# EAGLE design PIC 16F877A Board (EAGLE 9.6.2)
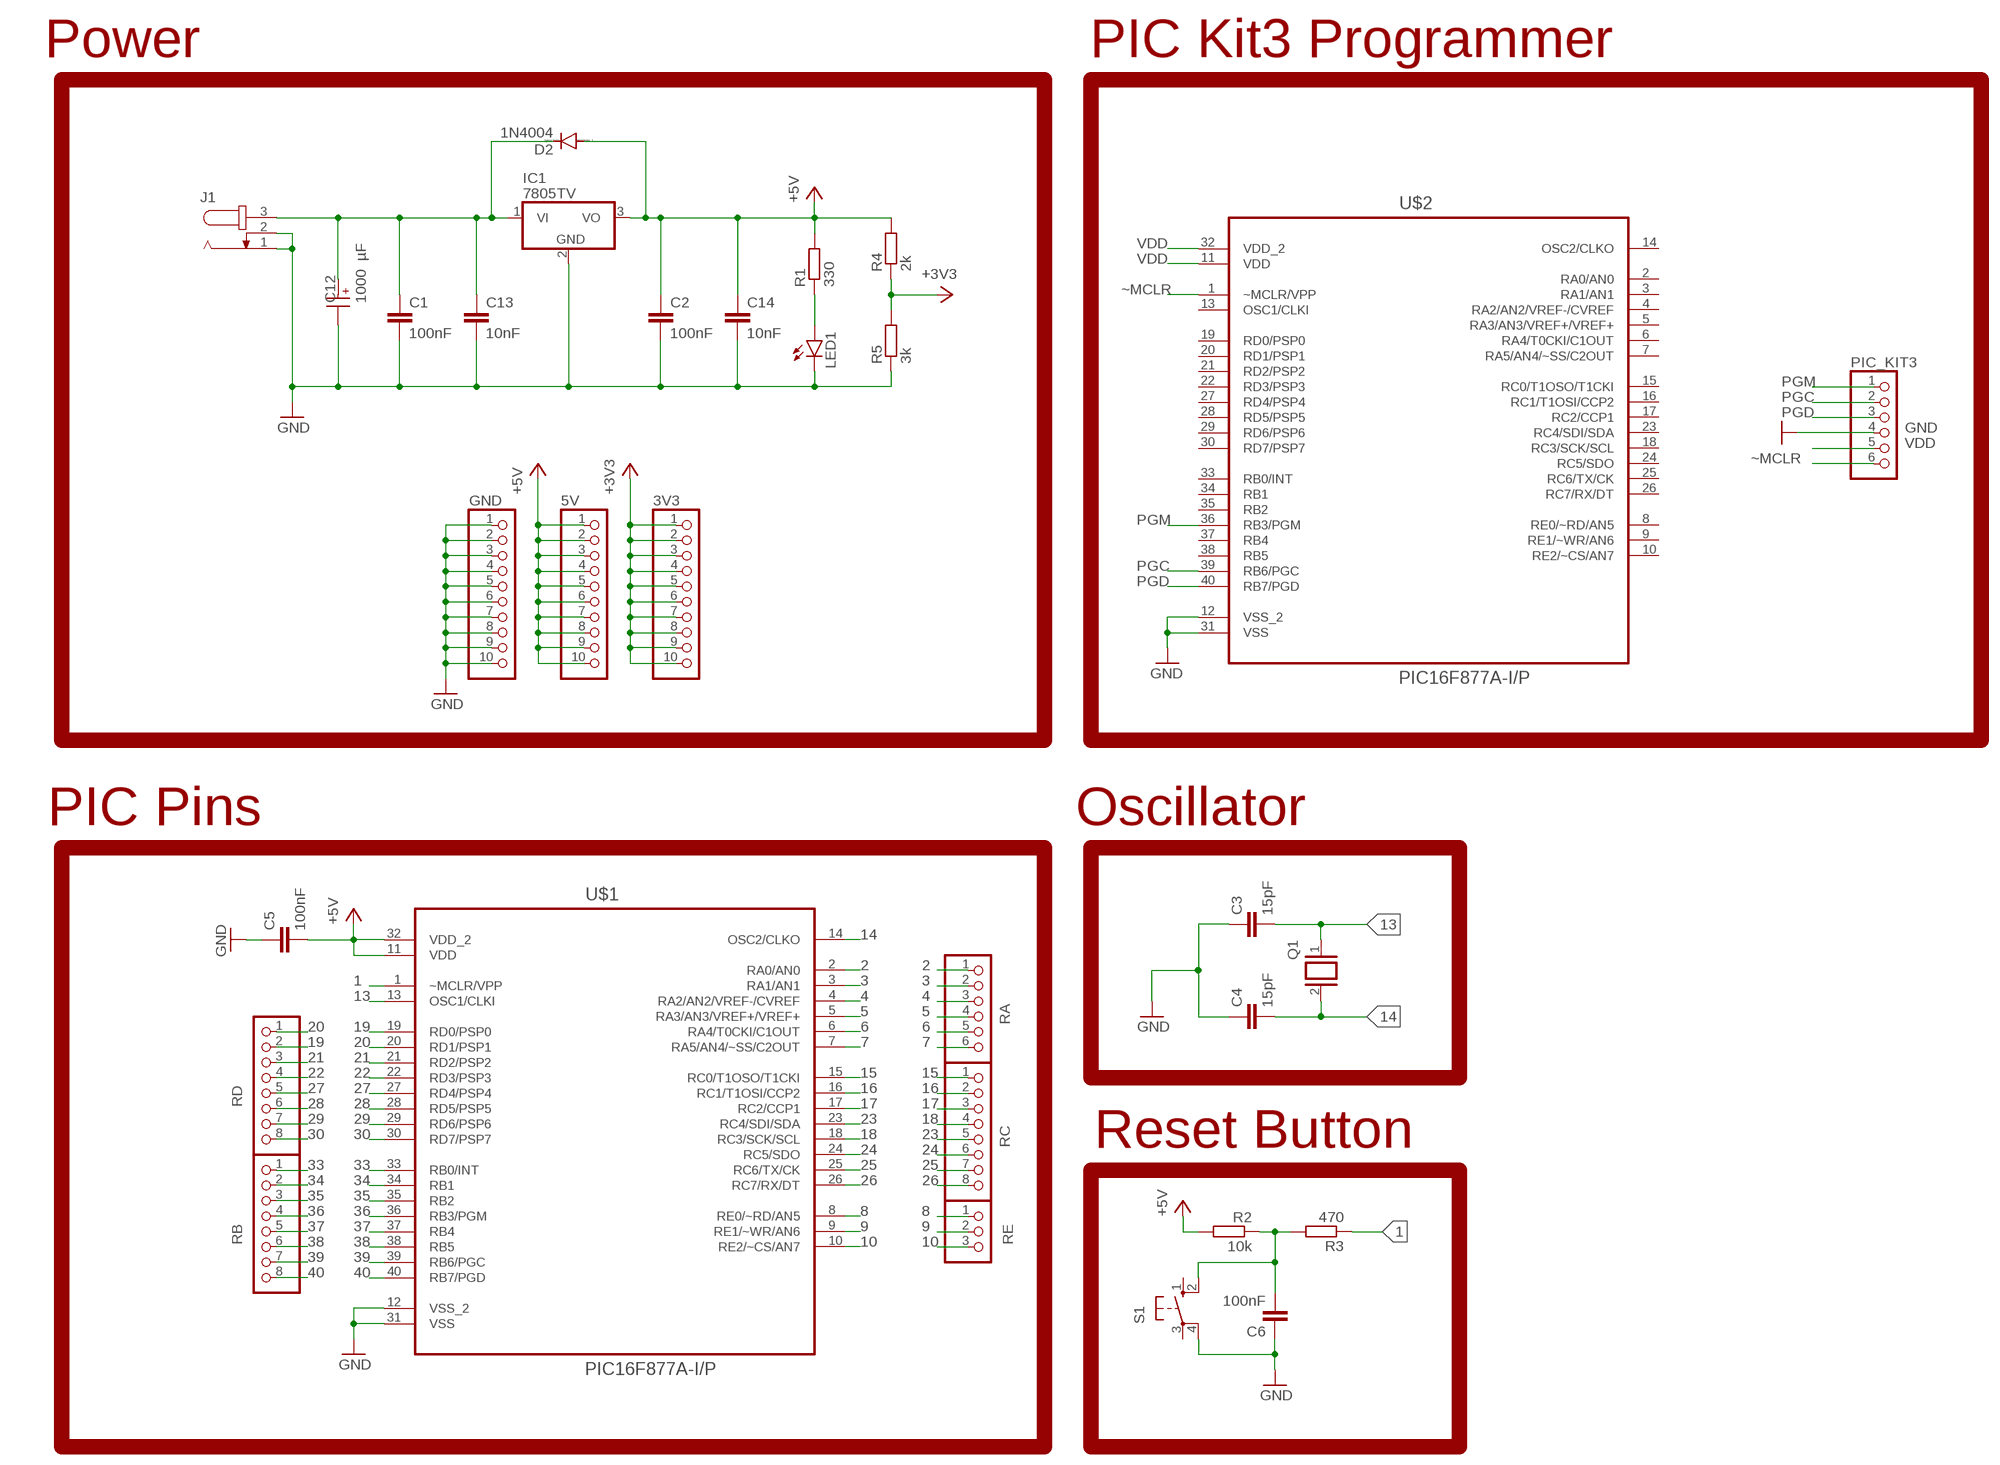
[diagram p0: schematic, sheet 1]

## Parts
3V3  PINHD-1X10  [1X10]
5V  PINHD-1X10  [1X10]
C1  100nF  C-EU025-025X050  [C025-025X050]
C2  100nF  C-EU025-025X050  [C025-025X050]
C3  15pF  C-EU025-025X050  [C025-025X050]
C4  15pF  C-EU025-025X050  [C025-025X050]
C5  100nF  C-EU025-025X050  [C025-025X050]
C6  100nF  C-EU025-025X050  [C025-025X050]
C12  1000 µF  WCAP-ATG8_10X12.5_860010275016  [WCAP-ATG8_10X12.5(DXL)]
C13  10nF  C-EU025-025X050  [C025-025X050]
C14  10nF  C-EU025-025X050  [C025-025X050]
D2  1N4004  [DO41-10]
GND  PINHD-1X10  [1X10]
IC1  7805TV  [TO220V]
J1  JACK-PLUG0  [SPC4077]
LED1  LED3MM  [LED3MM]
PIC_KIT3  PINHD-1X6  [1X06]
Q1  XTAL/S  [QS]
R1  330  R-EU_0204/7  [0204/7]
R2  10k  R-EU_0204/7  [0204/7]
R3  470  R-EU_0204/7  [0204/7]
R4  2k  R-EU_0204/7  [0204/7]
R5  3k  R-EU_0204/7  [0204/7]
RA  PINHD-1X6  [1X06]
RB  PINHD-1X8  [1X08]
RC  PINHD-1X8  [1X08]
RD  PINHD-1X8  [1X08]
RE  PINHD-1X3  [1X03]
S1  10-XX  [B3F-10XX]
U$1  PIC16F877A-I/P  [16F877A]
U$2  PIC16F877A-I/P  [16F877A]

## Nets
1: R3.1 U$1.1(~MCLR/VPP)
2: RA.1 U$1.2(RA0/AN0)
3: RA.2 U$1.3(RA1/AN1)
4: RA.3 U$1.4(RA2/AN2/VREF-/CVREF)
5: RA.4 U$1.5(RA3/AN3/VREF+/VREF+)
6: RA.5 U$1.6(RA4/T0CKI/C1OUT)
7: RA.6 U$1.7(RA5/AN4/~SS/C2OUT)
8: RE.1 U$1.8(RE0/~RD/AN5)
9: RE.2 U$1.9(RE1/~WR/AN6)
10: RE.3 U$1.10(RE2/~CS/AN7)
13: C3.2 Q1.1 U$1.13(OSC1/CLKI)
14: C4.2 Q1.2 U$1.14(OSC2/CLKO)
15: RC.1 U$1.15(RC0/T1OSO/T1CKI)
16: RC.2 U$1.16(RC1/T1OSI/CCP2)
17: RC.3 U$1.17(RC2/CCP1)
18: RC.4 U$1.18(RC3/SCK/SCL)
19: RD.2 U$1.19(RD0/PSP0)
20: RD.1 U$1.20(RD1/PSP1)
21: RD.3 U$1.21(RD2/PSP2)
22: RD.4 U$1.22(RD3/PSP3)
23: RC.5 U$1.23(RC4/SDI/SDA)
24: RC.6 U$1.24(RC5/SDO)
25: RC.7 U$1.25(RC6/TX/CK)
26: RC.8 U$1.26(RC7/RX/DT)
27: RD.5 U$1.27(RD4/PSP4)
28: RD.6 U$1.28(RD5/PSP5)
29: RD.7 U$1.29(RD6/PSP6)
30: RD.8 U$1.30(RD7/PSP7)
33: RB.1 U$1.33(RB0/INT)
34: RB.2 U$1.34(RB1)
35: RB.3 U$1.35(RB2)
36: RB.4 U$1.36(RB3/PGM)
37: RB.5 U$1.37(RB4)
38: RB.6 U$1.38(RB5)
39: RB.7 U$1.39(RB6/PGC)
40: RB.8 U$1.40(RB7/PGD)
+3V3: 3V3.1 3V3.2 3V3.3 3V3.4 3V3.5 3V3.6 3V3.7 3V3.8 3V3.9 3V3.10 R4.1 R5.2
+5V: 5V.1 5V.2 5V.3 5V.4 5V.5 5V.6 5V.7 5V.8 5V.9 5V.10 C2.1 C5.2 C14.1 D2.A IC1.3(VO) R1.2 R2.2 R4.2 U$1.11(VDD) U$1.32(VDD_2)
GND: C1.2 C2.2 C3.1 C4.1 C5.1 C6.1 C12.2(-) C13.2 C14.2 GND.1 GND.2 GND.3 GND.4 GND.5 GND.6 GND.7 GND.8 GND.9 GND.10 IC1.2(GND) J1.1 J1.2 LED1.K(C) PIC_KIT3.4 R5.1 S1.4(P1) U$1.12(VSS_2) U$1.31(VSS) U$2.12(VSS_2) U$2.31(VSS)
N$1: C1.1 C12.1(+) C13.1 D2.C IC1.1(VI) J1.3
N$2: C6.2 R2.1 R3.2 S1.2(S1)
N$4: LED1.A R1.1
PGC: PIC_KIT3.2 U$2.39(RB6/PGC)
PGD: PIC_KIT3.3 U$2.40(RB7/PGD)
PGM: PIC_KIT3.1 U$2.36(RB3/PGM)
VDD: PIC_KIT3.5 U$2.11(VDD) U$2.32(VDD_2)
~MCLR: PIC_KIT3.6 U$2.1(~MCLR/VPP)
Unconnected: S1.1(S) S1.3(P) U$2.2(RA0/AN0) U$2.3(RA1/AN1) U$2.4(RA2/AN2/VREF-/CVREF) U$2.5(RA3/AN3/VREF+/VREF+) U$2.6(RA4/T0CKI/C1OUT) U$2.7(RA5/AN4/~SS/C2OUT) U$2.8(RE0/~RD/AN5) U$2.9(RE1/~WR/AN6) U$2.10(RE2/~CS/AN7) U$2.13(OSC1/CLKI) U$2.14(OSC2/CLKO) U$2.15(RC0/T1OSO/T1CKI) U$2.16(RC1/T1OSI/CCP2) U$2.17(RC2/CCP1) U$2.18(RC3/SCK/SCL) U$2.19(RD0/PSP0) U$2.20(RD1/PSP1) U$2.21(RD2/PSP2) U$2.22(RD3/PSP3) U$2.23(RC4/SDI/SDA) U$2.24(RC5/SDO) U$2.25(RC6/TX/CK) U$2.26(RC7/RX/DT) U$2.27(RD4/PSP4) U$2.28(RD5/PSP5) U$2.29(RD6/PSP6) U$2.30(RD7/PSP7) U$2.33(RB0/INT) U$2.34(RB1) U$2.35(RB2) U$2.37(RB4) U$2.38(RB5)

## Notes on the sheet
- Power | PIC Kit3 Programmer
- PIC Pins | Oscillator
- Reset Button

## Library data of the parts
3V3 5V GND = pinhead:PINHD-1X10: PIN HEADER
C1-C6 C13 C14 = rcl:C-EU: CAPACITOR, European symbol; SPICEPREFIX: C
C12 = Aluminium Electrolyt Capacitors:WCAP-ATG8_10X12.5: WCAP-ATG8 Aluminium Electrolytic Capacitors General Purpose +85 °C Characteristics General purpose product series with max. operating temperature of +85 °C Wide range of capacitance value Mounting style: THT Radial Capacitance range: 0.1 µF ‒ 33000 µF Capacitance tolerance: ±20 % Voltage range (UR): 10 ‒ 400 V(DC) Operating temperature: -40 °C up to +85 °C for UR < 400 V(DC) -25 °C up to +85 °C for UR ≥ 400 V(DC) Endurance: 2000 h @ +85 °C Dimensions (DxL) in mm: 5.0 x 11.0 up to 22.0 x 51.0 Recommended soldering: Wave soldering Applications Filtering Smoothing Energy storage Coupling <https://www.we-online.com/catalog/media/o35732v209%20WCAP-ATG8_4C.jpg> Details see: https://www.we-online.com/catalog/en/WCAP-ATG8/ Updated by yingchun,Shan;2020-02-27 2020(C) Würth Elektronik; DATASHEET-URL: https://www.we-online.com/catalog/datasheet/860010275016.pdf; DF: 19%; DIAMETER: 10mm; I-LEAK: 100uA; I-RIPPLE: 726mA; L: 12.5mm; OPERATING-TEMPERATURE: -40 °C up to +85 °C; PART-NUMBER: 860010275016; PITCH: 5mm; TECHNICAL-REFERENCE: ATBF125102M010DSPA9B000; VR: 10V(DC)
D2 = diode:1N4004: DIODE general purpose rectifier, 1 A
IC1 = linear:78*: Positive VOLTAGE REGULATOR Source: http://cache.national.com/ds/LM/LM78L05.pdf http://www.fairchildsemi.com/ds/LM/LM7805.pdf
J1 = con-jack:JACK-PLUG: DC POWER JACK Power Jack, DC, Right Angle, Through Hole, Rated 5A at 16VDC, PC Terminals Distributor: Farnell (www.Farnell.de) Drawing: 84N1161.pdf / 84N1162.pdf Manufacturer: SPC Technology (www.spctechnology.com) Type: SPC4077 / SPC 4078; OC_FARNELL: unknown; OC_NEWARK: unknown
LED1 = led:LED: LED OSRAM: - CHIPLED LG R971, LG N971, LY N971, LG Q971, LY Q971, LO R971, LY R971 LH N974, LH R974 LS Q976, LO Q976, LY Q976 LO Q996 - Hyper CHIPLED LW Q18S LB Q993, LB Q99A, LB R99A - SideLED LS A670, LO A670, LY A670, LG A670, LP A670 LB A673, LV A673, LT A673, LW A673 LH A674 LY A675 LS A676, LA A676, LO A676, LY A676, LW A676 LS A679, LY A679, LG A679 - Hyper Micro SIDELED® LS Y876, LA Y876, LO Y876, LY Y876 LT Y87S - SmartLED LW L88C, LW L88S LB L89C, LB L89S, LG L890 LS L89K, LO L89K, LY L89K LS L896, LA L896, LO L896, LY L896 - TOPLED LS T670, LO T670, LY T670, LG T670, LP T670 LSG T670, LSP T670, LSY T670, LOP T670, LYG T670 LG T671, LOG T671, LSG T671 LB T673, LV T673, LT T673, LW T673 LH T674 LS T676, LA T676, LO T676, LY T676, LB T676, LH T676, LSB T676, LW T676 LB T67C, LV T67C, LT T67C, LS T67K, LO T67K, LY T67K, LW E67C LS E67B, LA E67B, LO E67B, LY E67B, LB E67C, LV E67C, LT E67C LW T67C LS T679, LY T679, LG T679 LS T770, LO T770, LY T770, LG T770, LP T770 LB T773, LV T773, LT T773, LW T773 LH T774 LS E675, LA E675, LY E675, LS T675 LS T776, LA T776, LO T776, LY T776, LB T776 LHGB T686 LT T68C, LB T68C - Hyper Mini TOPLED® LB M676 - Mini TOPLED Santana® LG M470 LS M47K, LO M47K, LY M47K Source: http://www.osram.convergy.de LUXEON: - LUMILED® LXK2-PW12-R00, LXK2-PW12-S00, LXK2-PW14-U00, LXK2-PW14-V00 LXK2-PM12-R00, LXK2-PM12-S00, LXK2-PM14-U00 LXK2-PE12-Q00, LXK2-PE12-R00, LXK2-PE12-S00, LXK2-PE14-T00, LXK2-PE14-U00 LXK2-PB12-K00, LXK2-PB12-L00, LXK2-PB12-M00, LXK2-PB14-N00, LXK2-PB14-P00, LXK2-PB14-Q00 LXK2-PR12-L00, LXK2-PR12-M00, LXK2-PR14-Q00, LXK2-PR14-R00 LXK2-PD12-Q00, LXK2-PD12-R00, LXK2-PD12-S00 LXK2-PH12-R00, LXK2-PH12-S00 LXK2-PL12-P00, LXK2-PL12-Q00, LXK2-PL12-R00 Source: www.luxeon.com KINGBRIGHT: KA-3528ASYC Source: www.kingbright.com
PIC_KIT3 RA = pinhead:PINHD-1X6: PIN HEADER
Q1 = special:XTAL/S: CRYSTAL
R1-R5 = rcl:R-EU_: RESISTOR, European symbol; SPICEPREFIX: R
RB RC RD = pinhead:PINHD-1X8: PIN HEADER
RE = pinhead:PINHD-1X3: PIN HEADER
S1 = switch-omron:10-XX: OMRON SWITCH; MPN: B3F-1000; OC_FARNELL: 176432; OC_NEWARK: 36M3542
U$1 U$2 = PIC - 16F877A:PIC16F877A-I/P: 8-Bit CMOS FLASH Microcontrollers Check prices <https://pricing.snapeda.com/parts/PIC16F877A-I/P/Microchip/view-part?ref=eda>; AVAILABILITY: Good; DESCRIPTION: PIC PIC® 16F Microcontroller IC 8-Bit 20MHz 14KB (8K x 14) FLASH 44-TQFP (10x10); MF: Microchip; MP: PIC16F877A-I/P; PACKAGE: DIP-40 Microchip; PRICE: None; PURCHASE-URL: https://pricing.snapeda.com/search/part/PIC16F877A-I/P/?ref=eda

## Board
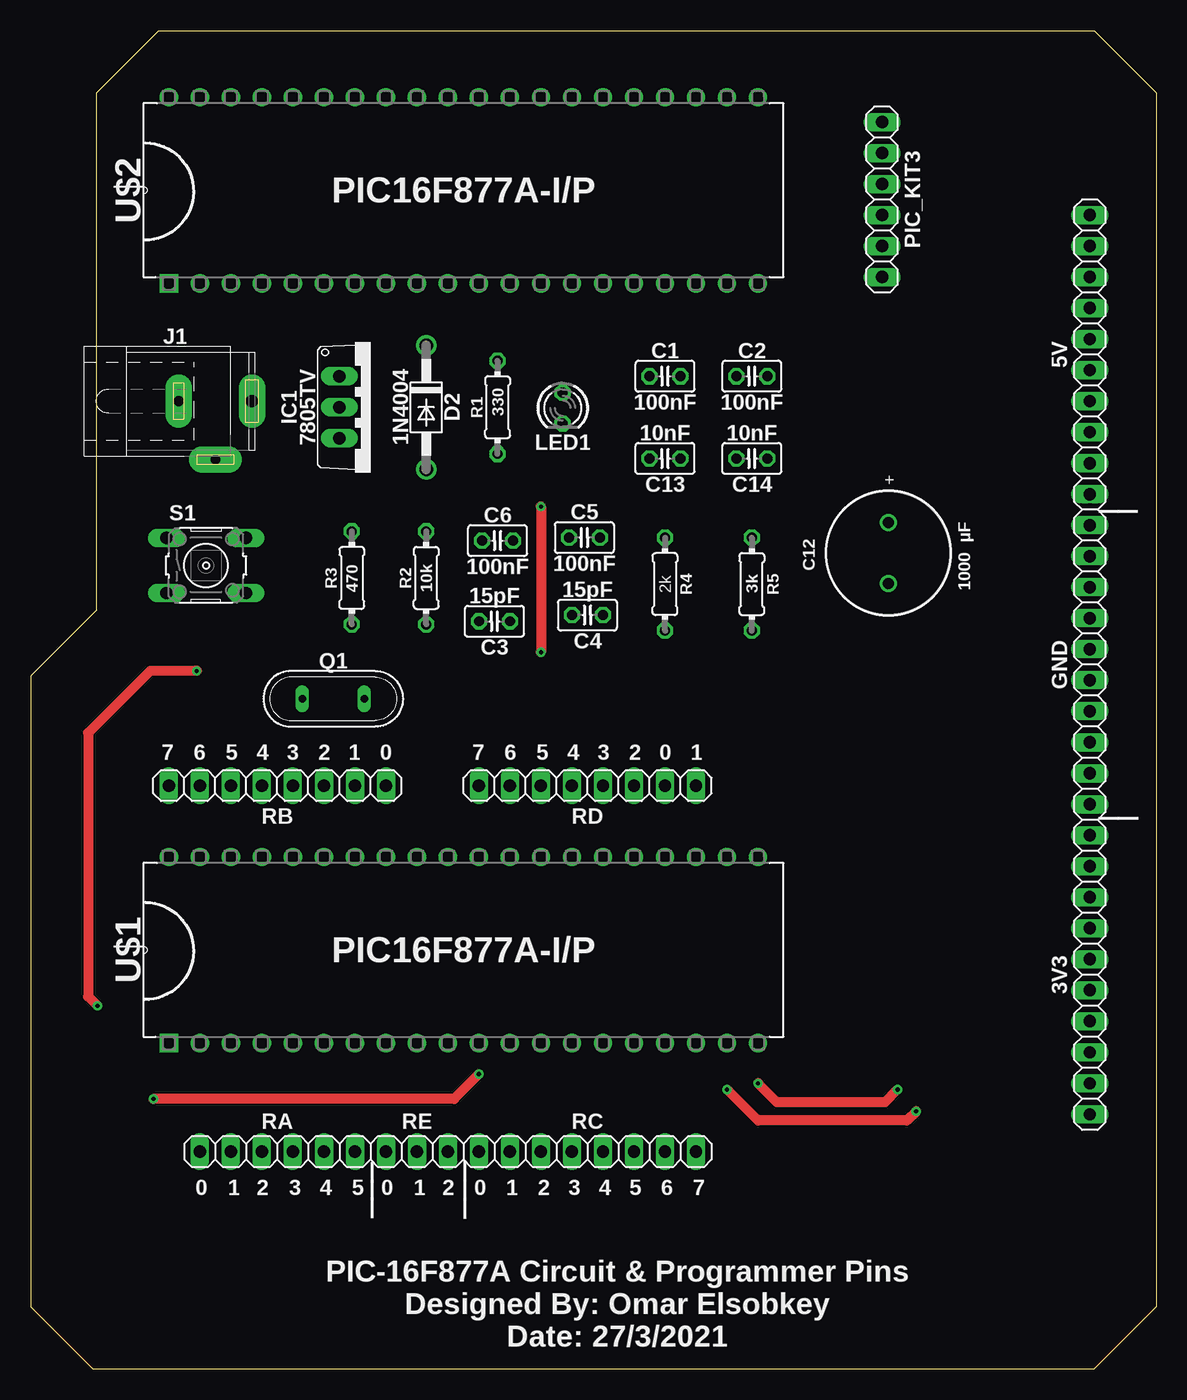
[diagram p1: board, top side]
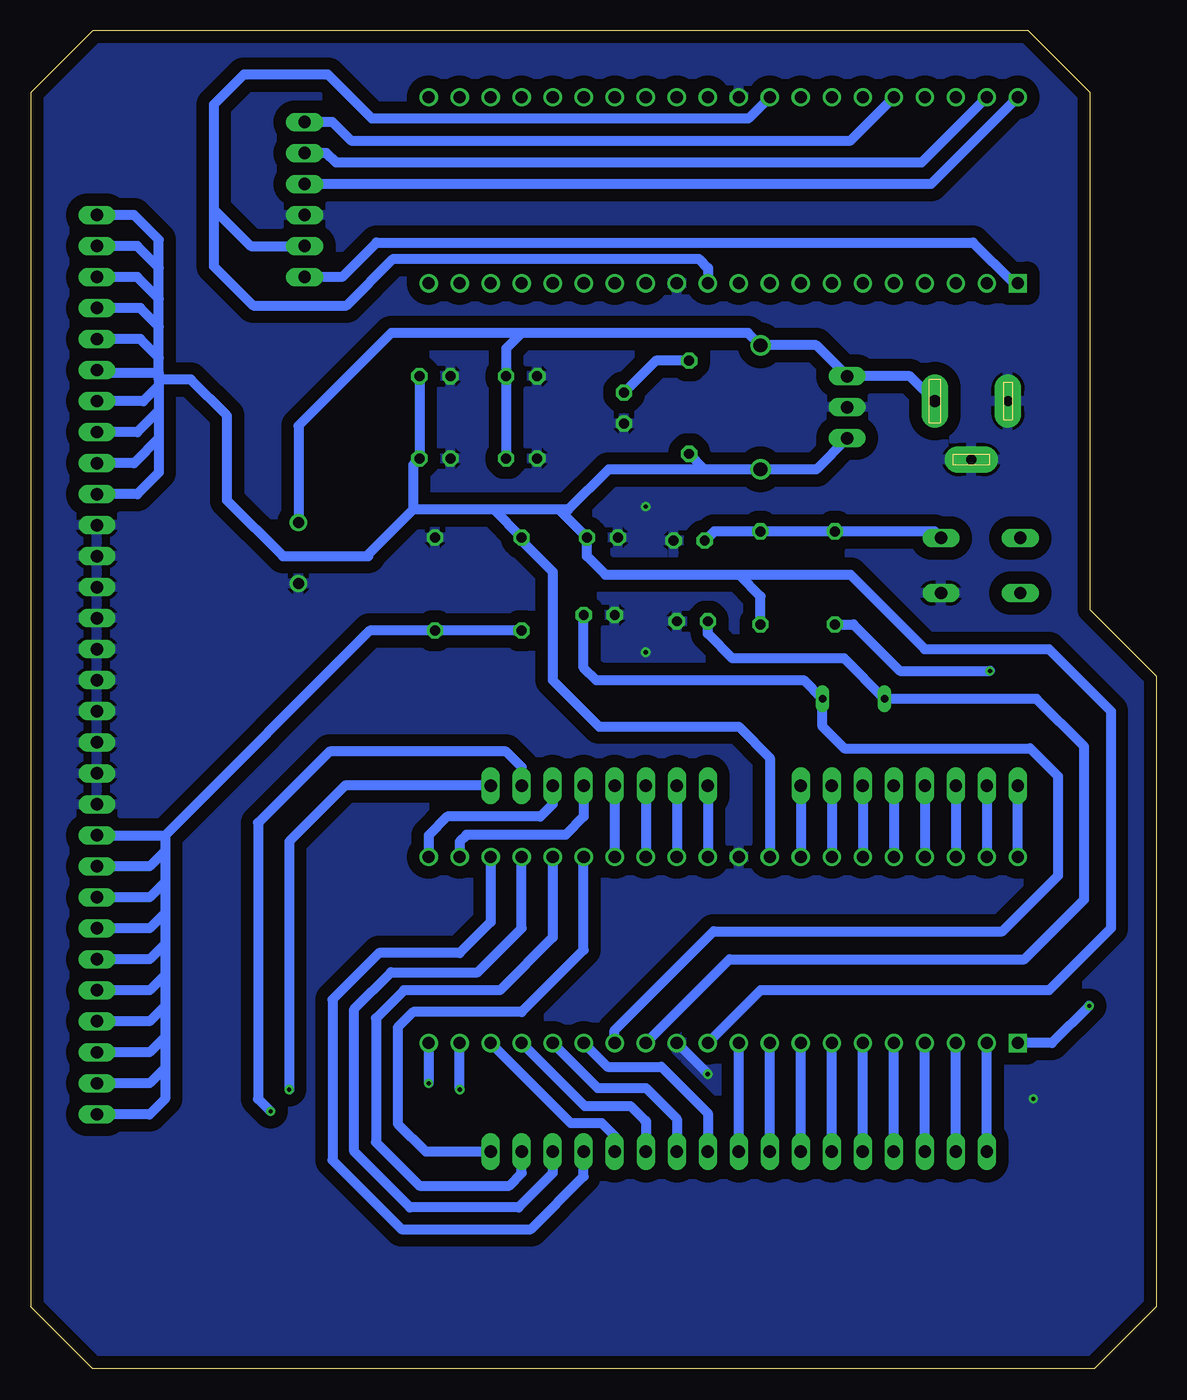
[diagram p2: board, bottom side, seen from below]

Size 92.2 x 109.63 mm. Coordinates in mm from the lower left corner, seen from the top.
Outline: 5.41,62.18 5.41,104.55 10.49,109.63 87.12,109.63 92.2,104.55 92.2,5.08 87.12,0 5.08,0 0,5.08 0,56.77 5.41,62.18
Copper layers (1*16): Top 0.035mm / dielectric 1.5mm / Bottom 0.035mm
Design rules "default *": minimum track width 32mil, minimum drill 0.35mm, track to track 16mil, track to pad 16mil, pad to pad 6mil, via to via 6mil, smd to smd 6mil, copper to edge 40mil, drill to drill 6mil, minimum pad ring 10mil, minimum via ring 8mil, stop-mask expansion 4mil, vias tented up to drill 0mil, thermal gap 10mil

### Footprints (pad centres in the part's own frame; a part is rotated, then mirrored left to right if it is on the bottom)
1X10 = drill 1.016 long: 1 -11.43,0; 2 -8.89,0; 3 -6.35,0; 4 -3.81,0; 5 -1.27,0; 6 1.27,0; 7 3.81,0; 8 6.35,0; 9 8.89,0; 10 11.43,0
C025-025X050 = drill 0.813 octagon: 1 -1.27,0; 2 1.27,0
WCAP-ATG8_10X12.5(DXL) = drill 0.9: 1 2.5,0; 2 -2.5,0
DO41-10 = drill 1.118: A 5.08,0; C -5.08,0
TO220V = drill 1.016 long: 1 -2.54,-2.54; 2 0,-2.54; 3 2.54,-2.54
SPC4077 = drill 0.8 pad 2.184 long: 1 -3,0; 2 0,-4.8 | drill 1 pad 2.184 long: 3 3,0
LED3MM = drill 0.813 octagon: A -1.27,0; K 1.27,0
1X06 = drill 1.016 long: 1 -6.35,0; 2 -3.81,0; 3 -1.27,0; 4 1.27,0; 5 3.81,0; 6 6.35,0
QS = drill 0.61 long: 1 -2.54,0; 2 2.54,0
0204/7 = drill 0.813 octagon: 1 -3.81,0; 2 3.81,0
1X08 = drill 1.016 long: 1 -8.89,0; 2 -6.35,0; 3 -3.81,0; 4 -1.27,0; 5 1.27,0; 6 3.81,0; 7 6.35,0; 8 8.89,0
1X03 = drill 1.016 long: 1 -2.54,0; 2 0,0; 3 2.54,0
B3F-10XX = drill 1.016 long: 1 -3.251,2.261; 2 3.251,2.261; 3 -3.251,-2.261; 4 3.251,-2.261
16F877A = drill 0.991 square: 1 -15.24,48.26 | drill 0.991: 2 -15.24,45.72; 3 -15.24,43.18; 4 -15.24,40.64; 5 -15.24,38.1; 6 -15.24,35.56; 7 -15.24,33.02; 8 -15.24,30.48; 9 -15.24,27.94; 10 -15.24,25.4; 11 -15.24,22.86; 12 -15.24,20.32; 13 -15.24,17.78; 14 -15.24,15.24; 15 -15.24,12.7; 16 -15.24,10.16; 17 -15.24,7.62; 18 -15.24,5.08; 19 -15.24,2.54; 20 -15.24,0; 21 0,0; 22 0,2.54; 23 0,5.08; 24 0,7.62; 25 0,10.16; 26 0,12.7; 27 0,15.24; 28 0,17.78; 29 0,20.32; 30 0,22.86; 31 0,25.4; 32 0,27.94; 33 0,30.48; 34 0,33.02; 35 0,35.56; 36 0,38.1; 37 0,40.64; 38 0,43.18; 39 0,45.72; 40 0,48.26

### Placement (x,y rotation side)
3V3  86.77,32.28 270 top
5V  86.77,83.08 270 top
C1  51.97,81.31 180 top
C2  59.08,81.31 180 top
C3  38,61.24 180 top
C4  45.62,61.75 0 top
C5  45.36,68.1 0 top
C6  38.25,67.84 180 top
C12  70.26,66.83 90 top
C13  51.97,74.57 180 top
C14  59.08,74.57 180 top
D2  32.41,78.77 270 top
GND  86.77,57.68 270 top
IC1  27.84,78.77 270 top
J1  15.14,79.27 0 top
LED1  43.59,78.7 270 top
PIC_KIT3  69.75,95.78 270 top
Q1  24.79,54.89 0 top
R1  38.25,78.77 270 top
R2  32.41,64.8 270 top
R3  26.31,64.8 90 top
R4  51.97,64.29 90 top
R5  59.08,64.29 270 top
RA  20.22,17.81 0 top
RB  20.22,47.78 180 top
RC  45.62,17.81 0 top
RD  45.62,47.78 180 top
RE  31.65,17.81 0 top
S1  14.38,65.81 0 top
U$1  59.59,41.94 90 top
U$2  59.59,104.17 90 top

### Tracks (layer width: path | path; a pad name or v marks a point on that pad's centre or on a via)
1  (via drill 0.35)
  Top 0.813: v13.61,57.18 9.8,57.18 4.72,52.1 4.72,30.51 v5.49,29.74
  Bottom 0.813: R3.1 24.79,60.99 20.98,57.18 v13.61,57.18 | v5.49,29.74 8.53,26.7 U$1.1
2
  Bottom 0.813: RA.1 U$1.2
3
  Bottom 0.813: RA.2 U$1.3
4
  Bottom 0.813: RA.3 U$1.4
5
  Bottom 0.813: RA.4 U$1.5
6
  Bottom 0.813: RA.5 U$1.6
7
  Bottom 0.813: RA.6 U$1.7
8
  Bottom 0.813: RE.1 U$1.8
9
  Bottom 0.813: RE.2 U$1.9
10
  Bottom 0.813: RE.3 U$1.10
13
  Bottom 0.813: U$1.13 34.95,33.55 10.78,33.55 5.89,38.44 5.89,50.98 9.8,54.89 Q1.1 25.55,58.19 34.7,58.19 36.73,60.22 C3.2
14
  Bottom 0.813: U$1.14 44.35,27.75 36.26,35.84 12.6,35.84 8.03,40.41 8.03,48.54 10.31,50.83 25.55,50.83 27.33,52.6 Q1.2 28.85,56.41 45.87,56.41 46.89,57.43 C4.2
15
  Bottom 0.813: U$1.15 44.95,24.76 40.54,24.76 36.73,20.95 RC.1
16
  Bottom 0.813: U$1.16 45.75,23.02 41.81,23.02 39.27,20.48 RC.2
17
  Bottom 0.813: U$1.17 46.81,21.53 43.08,21.53 41.89,20.35 41.81,20.35 RC.3
18
  Bottom 0.813: U$1.18 47.96,20.14 45.42,20.14 44.35,19.08 RC.4
19  (via drill 0.35)
  Top 0.813: v72.54,21.11 71.78,20.35 59.59,20.35 v57.05,22.89
  Bottom 0.813: RD.2 51.97,49.3 53.24,50.57 67.72,50.57 73.56,44.73 73.56,22.12 v72.54,21.11 | v57.05,22.89 U$1.19
20  (via drill 0.35)
  Top 0.813: v59.59,23.39 61.11,21.87 70,21.87 v71.02,22.89
  Bottom 0.813: RD.1 66.45,47.78 71.02,43.21 v71.02,22.89 | U$1.20 v59.59,23.39
21
  Bottom 0.813: RD.3 49.43,46.25 50.44,45.24 58.06,45.24 59.59,43.71 U$1.21
22
  Bottom 0.813: RD.4 46.89,45.24 48.37,43.75 56.5,43.75 57.05,43.21 U$1.22
23
  Bottom 0.813: U$1.23 54.51,36.6 57.05,34.06 63.65,34.06 67.46,30.25 67.46,17.1 61.82,11.46 51.21,11.46 46.89,15.77 RC.5
24
  Bottom 0.813: RC.6 49.43,16.03 52.22,13.23 61.11,13.23 65.68,17.81 65.68,29.49 62.69,32.49 55.58,32.49 51.97,36.09 U$1.24
25
  Bottom 0.813: U$1.25 49.43,35.33 53.75,31.01 61.62,31.01 63.91,28.73 63.91,18.57 60.35,15.01 52.98,15.01 51.97,16.03 RC.7
26
  Bottom 0.813: RC.8 59.84,17.81 62.13,20.09 62.13,27.97 60.86,29.24 51.97,29.24 46.89,34.32 U$1.26
27
  Bottom 0.813: RD.5 U$1.27
28
  Bottom 0.813: RD.6 U$1.28
29
  Bottom 0.813: RD.7 U$1.29
30
  Bottom 0.813: RD.8 U$1.30
33
  Bottom 0.813: RB.1 U$1.33
34
  Bottom 0.813: RB.2 U$1.34
35
  Bottom 0.813: RB.3 U$1.35
36
  Bottom 0.813: RB.4 U$1.36
37
  Bottom 0.813: RB.5 U$1.37
38
  Bottom 0.813: RB.6 U$1.38
39
  Bottom 0.813: RB.7 U$1.39
40
  Bottom 0.813: U$1.40 RB.8
+3V3
  Bottom 0.813: R4.1 R5.2 64.41,60.48 81.18,43.71 | 3V3.1 81.18,43.71 | 81.18,43.71 81.18,42.44 | 81.18,42.44 82.45,41.17 3V3.2 | 81.18,42.44 81.18,39.9 | 81.18,39.9 82.45,38.63 3V3.3 | 81.18,39.9 81.18,37.36 | 81.18,37.36 82.45,36.09 3V3.4 | 81.18,37.36 81.18,34.82 | 81.18,34.82 82.45,33.55 3V3.5 | 81.18,34.82 81.18,32.28 | 81.18,32.28 82.45,31.01 3V3.6 | 81.18,32.28 81.18,29.74 | 81.18,29.74 82.45,28.47 3V3.7 | 81.18,29.74 81.18,27.2 | 81.18,27.2 82.45,25.93 3V3.8 | 81.18,27.2 81.18,24.66 | 81.18,24.66 82.45,23.39 3V3.9 | 81.18,24.66 81.18,22.12 82.45,20.85 3V3.10
+5V
  Bottom 0.813: C2.1 C14.1 60.86,74.07 60.86,70.38 | 64.67,66.57 71.53,66.57 76.1,71.15 76.1,78.08 79.07,81.05 81.69,81.05 | 64.67,66.57 64.54,66.57 | 54.25,70.38 R4.2 51.97,67.84 49.43,65.3 49.43,56.41 45.62,52.6 34.19,52.6 31.65,50.06 U$1.32 | 54.25,70.38 60.86,70.38 | IC1.3 27.84,73.69 D2.A 36.98,73.69 | 36.98,73.69 R1.2 | 36.98,73.69 44.86,73.69 48.16,70.38 48.92,70.38 | 34.19,65.05 32.41,63.27 R2.2 | 34.19,65.05 45.11,65.05 46.63,66.57 C5.2 48.92,70.38 | 48.92,70.38 54.25,70.38 | 60.86,70.38 64.67,66.57 | 34.19,65.05 25.04,65.05 18.95,58.95 8.79,58.95 3.71,53.87 3.71,36.09 8.79,31.01 32.41,31.01 U$1.11 | 81.69,81.56 86.51,81.56 5V.6 | 81.69,81.05 81.69,80.54 | 81.69,80.54 82.96,79.27 5V.7 | 81.69,80.54 81.69,78.51 | 5V.8 83.46,76.73 81.69,78.51 | 81.69,78.51 81.69,76.23 | 5V.9 83.72,74.19 81.69,76.23 | 81.69,76.23 81.69,73.43 83.46,71.65 5V.10 | 81.69,81.05 81.69,81.56 | 81.69,81.56 81.69,82.83 | 81.69,82.83 83.21,84.35 5V.5 | 81.69,82.83 81.69,85.37 | 81.69,85.37 83.21,86.89 5V.4 | 81.69,85.37 81.69,87.66 | 81.69,87.66 83.46,89.43 5V.3 | 81.69,87.66 81.69,90.2 | 5V.2 83.46,91.97 81.69,90.2 | 81.69,90.2 81.69,92.48 83.72,94.51 5V.1
GND  (via drill 0.35)
  Top 0.813: v36.73,24.16 34.7,22.12 v10.06,22.12 | v41.81,70.64 v41.81,58.7
  Bottom 0.813: U$1.12 v36.73,24.16
  pour Bottom (isolate 1.016): -3.38,109.25 95.22,109.25 95.22,-2.46 -3.38,-2.46
N$1
  Bottom 0.813: J1.3 20.17,81.31 IC1.1 27.84,83.85 D2.C 33.43,84.86 51.97,84.86 | 51.97,84.86 53.24,83.59 C1.1 C13.1 | 51.97,84.86 62.66,84.86 70.26,77.27 C12.1
N$2
  Bottom 0.813: S1.2 18.16,68.61 R3.2 R2.1 36.22,68.61 C6.2
N$4
  Bottom 0.813: R1.1 40.98,82.58 LED1.A
PGC
  Bottom 0.813: U$2.39 19.2,98.83 67.21,98.83 67.97,99.59 PIC_KIT3.2
PGD
  Bottom 0.813: U$2.40 18.44,97.05 PIC_KIT3.3
PGM
  Bottom 0.813: U$2.36 25.04,100.61 65.94,100.61 67.46,102.13 PIC_KIT3.1
VDD
  Bottom 0.813: U$2.32 33.4,102.41 64.24,102.41 67.84,106.02 74.73,106.02 77.19,103.56 77.19,95 | 77.19,95 74.17,91.97 PIC_KIT3.5 | 77.19,95 77.19,90.32 73.96,87.1 66.32,87.1 62.48,90.93 37.47,90.93 36.7,90.17 36.7,88.95 U$2.11
~MCLR
  Bottom 0.813: U$2.1 11.66,88.93 15,92.27 63.87,92.27 66.7,89.43 PIC_KIT3.6

### Text on the board
tPlace: | | | | 7 | 6 | 5 | 4 | 3 | 2 | 1 | 0 | 7 | 6 | 5 | 4 | 3 | 2 | 0 | 1 | | | | | | | | | 0 | 1 | 2 | 3 | 4 | 5 | | | 0 | 1 | 2 | | | 0 | 1 | 2 | 3 | 4 | 5 | 6 | 7 | | | |
tNames: PIC-16F877A Circuit & Programmer Pins / Designed By: Omar Elsobkey / Date: 27/3/2021